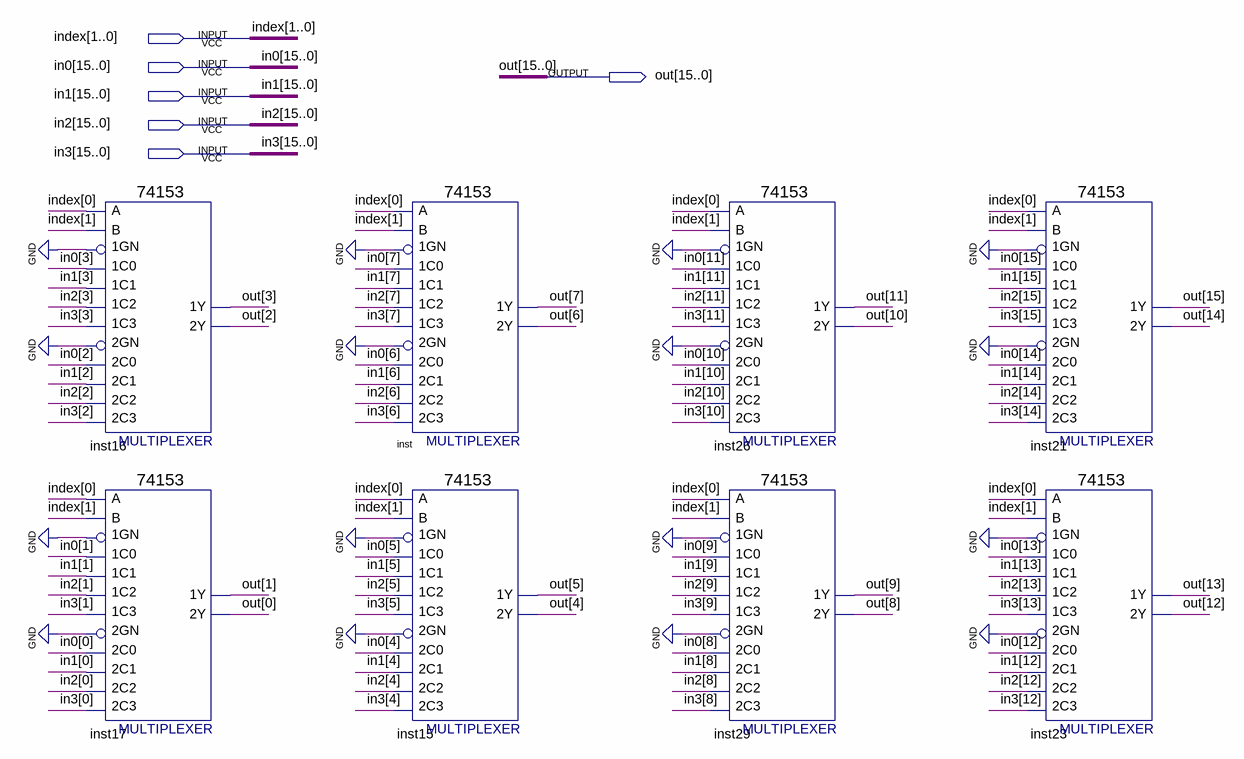
[diagram p0: schematic sheet]
// Quartus schematic mux4x1_16.bdf as structural Verilog: 8 symbols, 6 pins
module mux4x1_16 (
  input  [1:0] index,
  input  [15:0] in0,
  input  [15:0] in1,
  input  [15:0] in2,
  input  [15:0] in3,
  output [15:0] out
);

  \74153  inst16 (
    .\1C1 (in1[3]), .\1GN (1'b0), .\1C0 (in0[3]), .\2C0 (in0[2]), .\2GN (1'b0), .\2C2 (in2[2]),
    .\1C2 (in2[3]), .\1C3 (in3[3]), .B(index[1]), .A(index[0]), .\2C1 (in1[2]), .\2C3 (in3[2]),
    .\1Y (out[3]), .\2Y (out[2]));
  \74153  inst17 (
    .\1C1 (in1[1]), .\1GN (1'b0), .\1C0 (in0[1]), .\2C0 (in0[0]), .\2GN (1'b0), .\2C2 (in2[0]),
    .\1C2 (in2[1]), .\1C3 (in3[1]), .B(index[1]), .A(index[0]), .\2C1 (in1[0]), .\2C3 (in3[0]),
    .\1Y (out[1]), .\2Y (out[0]));
  \74153  inst (
    .\1C1 (in1[7]), .\1GN (1'b0), .\1C0 (in0[7]), .\2C0 (in0[6]), .\2GN (1'b0), .\2C2 (in2[6]),
    .\1C2 (in2[7]), .\1C3 (in3[7]), .B(index[1]), .A(index[0]), .\2C1 (in1[6]), .\2C3 (in3[6]),
    .\1Y (out[7]), .\2Y (out[6]));
  \74153  inst15 (
    .\1C1 (in1[5]), .\1GN (1'b0), .\1C0 (in0[5]), .\2C0 (in0[4]), .\2GN (1'b0), .\2C2 (in2[4]),
    .\1C2 (in2[5]), .\1C3 (in3[5]), .B(index[1]), .A(index[0]), .\2C1 (in1[4]), .\2C3 (in3[4]),
    .\1Y (out[5]), .\2Y (out[4]));
  \74153  inst26 (
    .\1C1 (in1[11]), .\1GN (1'b0), .\1C0 (in0[11]), .\2C0 (in0[10]), .\2GN (1'b0), .\2C2 (in2[10]),
    .\1C2 (in2[11]), .\1C3 (in3[11]), .B(index[1]), .A(index[0]), .\2C1 (in1[10]), .\2C3 (in3[10]),
    .\1Y (out[11]), .\2Y (out[10]));
  \74153  inst29 (
    .\1C1 (in1[9]), .\1GN (1'b0), .\1C0 (in0[9]), .\2C0 (in0[8]), .\2GN (1'b0), .\2C2 (in2[8]),
    .\1C2 (in2[9]), .\1C3 (in3[9]), .B(index[1]), .A(index[0]), .\2C1 (in1[8]), .\2C3 (in3[8]),
    .\1Y (out[9]), .\2Y (out[8]));
  \74153  inst21 (
    .\1C1 (in1[15]), .\1GN (1'b0), .\1C0 (in0[15]), .\2C0 (in0[14]), .\2GN (1'b0), .\2C2 (in2[14]),
    .\1C2 (in2[15]), .\1C3 (in3[15]), .B(index[1]), .A(index[0]), .\2C1 (in1[14]), .\2C3 (in3[14]),
    .\1Y (out[15]), .\2Y (out[14]));
  \74153  inst23 (
    .\1C1 (in1[13]), .\1GN (1'b0), .\1C0 (in0[13]), .\2C0 (in0[12]), .\2GN (1'b0), .\2C2 (in2[12]),
    .\1C2 (in2[13]), .\1C3 (in3[13]), .B(index[1]), .A(index[0]), .\2C1 (in1[12]), .\2C3 (in3[12]),
    .\1Y (out[13]), .\2Y (out[12]));
endmodule
